# EAGLE design untitled (EAGLE 6.5.0)
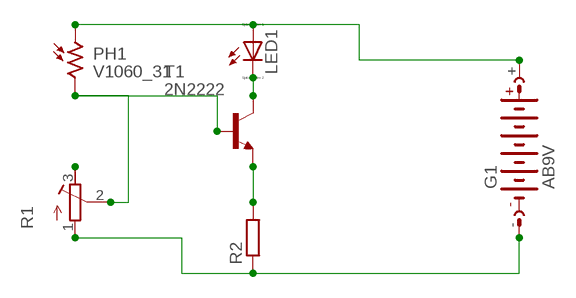
[diagram p0: schematic, sheet 1]

## Parts
G1  AB9V  [AB9V]
LED1  LED_ELD260  [LED_LD260]
PH1  V1060_31  [TO-5_V10]
R1  R-TRIMM4G/J  [RTRIM4G/J]
R2  R-EU_0204/2V  [0204V]
T1  2N2222  [TO18]

## Nets
N$1: G1.+ LED1.A PH1.1
N$3: LED1.K(C) T1.3(C)
N$7: R1.3(E)
N$8: G1.- R1.1(A) R2.1
N$11: R2.2 T1.1(E)
N$14: PH1.2 R1.2(S) T1.2(B)

## Library data of the parts
G1 = battery:AB9V: 9-V BATTERY CLIP
LED1 = eagle-ltspice:LED_E: LED Source: http://www.osram.convergy.de Source: www.luxeon.com Source: www.kingbright.com; SPICEMODEL: NONE; SPICEPREFIX: D; SPICETYPE: diode
PH1 = photo-elements:?1060*: Sensor Street Light control Source: http://optoelectronics.perkinelmer.com/content/Datasheets/DTS_PhotocellsB1060.pdf
R1 = rcl:R-TRIMM: Trimm resistor
R2 = rcl:R-EU_: RESISTOR, European symbol
T1 = transistor:2N2222: NPN TRANSISTOR

## Board
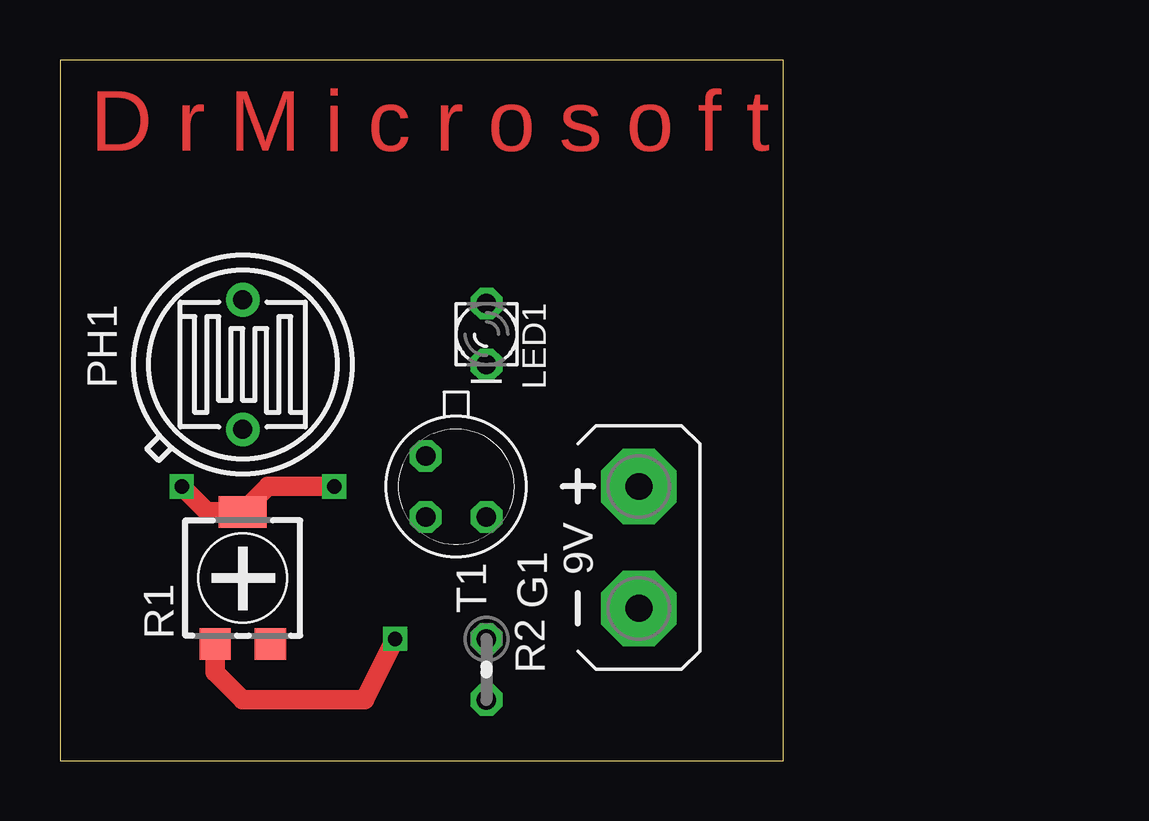
[diagram p1: board, top side]
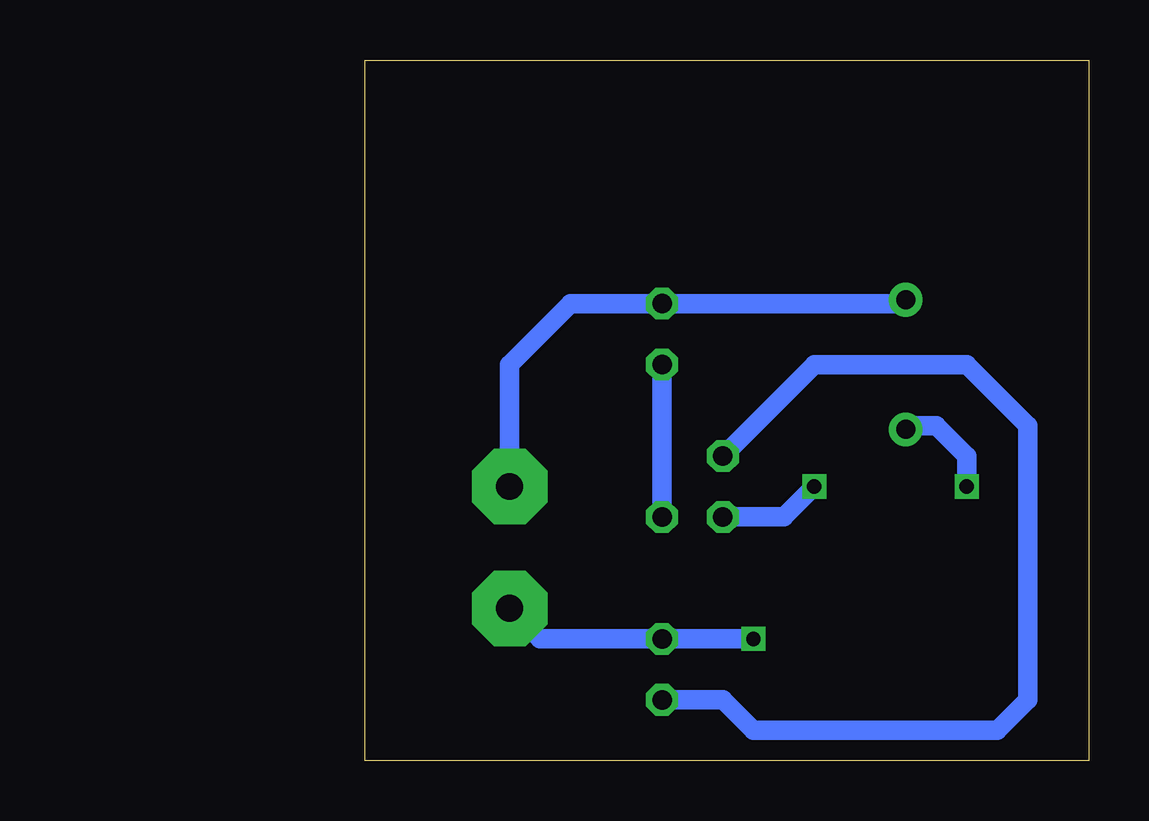
[diagram p2: board, bottom side, seen from below]

Size 30.15 x 29.2 mm. Coordinates in mm from the lower left corner, seen from the top.
Outline: 0,0 30.15,0 30.15,29.2 0,29.2 0,0
Copper layers (1*16): Top 0.035mm / dielectric 1.5mm / Bottom 0.035mm
Design rules "default *": minimum track width 10mil, minimum drill 24mil, track to track 5mm, track to pad 8mil, pad to pad 8mil, via to via 8mil, smd to smd 8mil, copper to edge 60mil, drill to drill 8mil, minimum pad ring 10mil, minimum via ring 8mil, stop-mask expansion 4mil, vias tented up to drill 0mil, thermal gap 10mil

### Footprints (pad centres in the part's own frame; a part is rotated, then mirrored left to right if it is on the bottom)
AB9V = drill 1.118 pad 3.15 octagon: + 0,2.54; - 0,-2.54
LED_LD260 = drill 0.813 octagon: A -1.27,0; K 1.27,0
TO-5_V10 = drill 0.8 pad 1.4: 1 -2.7,0; 2 2.7,0
RTRIM4G/J = smd 1.3 x 1.3: 1 -1.15,-2.75; 3 1.15,-2.75 | smd 2 x 1.3: 2 0,2.75
0204V = drill 0.813 octagon: 1 -1.27,0; 2 1.27,0
TO18 = drill 0.813 octagon: 1 -1.27,-1.27; 2 1.27,-1.27; 3 1.27,1.27

### Placement (x,y rotation side)
G1  24.13,8.89 0 top
LED1  17.78,17.78 270 top
PH1  7.62,16.51 270 top
R1  7.62,7.62 0 top
R2  17.78,3.81 270 top
T1  16.51,11.43 270 top

### Tracks (layer width: path | path; a pad name or v marks a point on that pad's centre or on a via)
N$1
  Bottom 0.813: G1.+ 24.13,16.51 21.59,19.05 LED1.A 7.78,19.05 PH1.1
N$3
  Bottom 0.813: LED1.K T1.3
N$8  (via drill 0.6)
  Top 0.813: R1.1 6.47,3.69 7.62,2.54 12.7,2.54 v13.97,5.08
  Bottom 0.813: G1.- 22.86,5.08 R2.1 v13.97,5.08
N$11
  Bottom 0.813: T1.1 11.43,16.51 5.08,16.51 2.54,13.97 2.54,2.54 3.81,1.27 13.97,1.27 15.24,2.54 R2.2
N$14  (via drill 0.6)
  Top 0.813: v11.43,11.43 8.68,11.43 R1.2 6.14,10.37 v5.08,11.43
  Bottom 0.813: T1.2 12.7,10.16 v11.43,11.43 | v5.08,11.43 5.08,12.7 6.35,13.97 7.46,13.97 PH1.2

### Text on the board
Top: D r M i c r o s o f t